# EAGLE design RAM-Rombox (EAGLE 6.5.0)

## Sheet 1 of 2
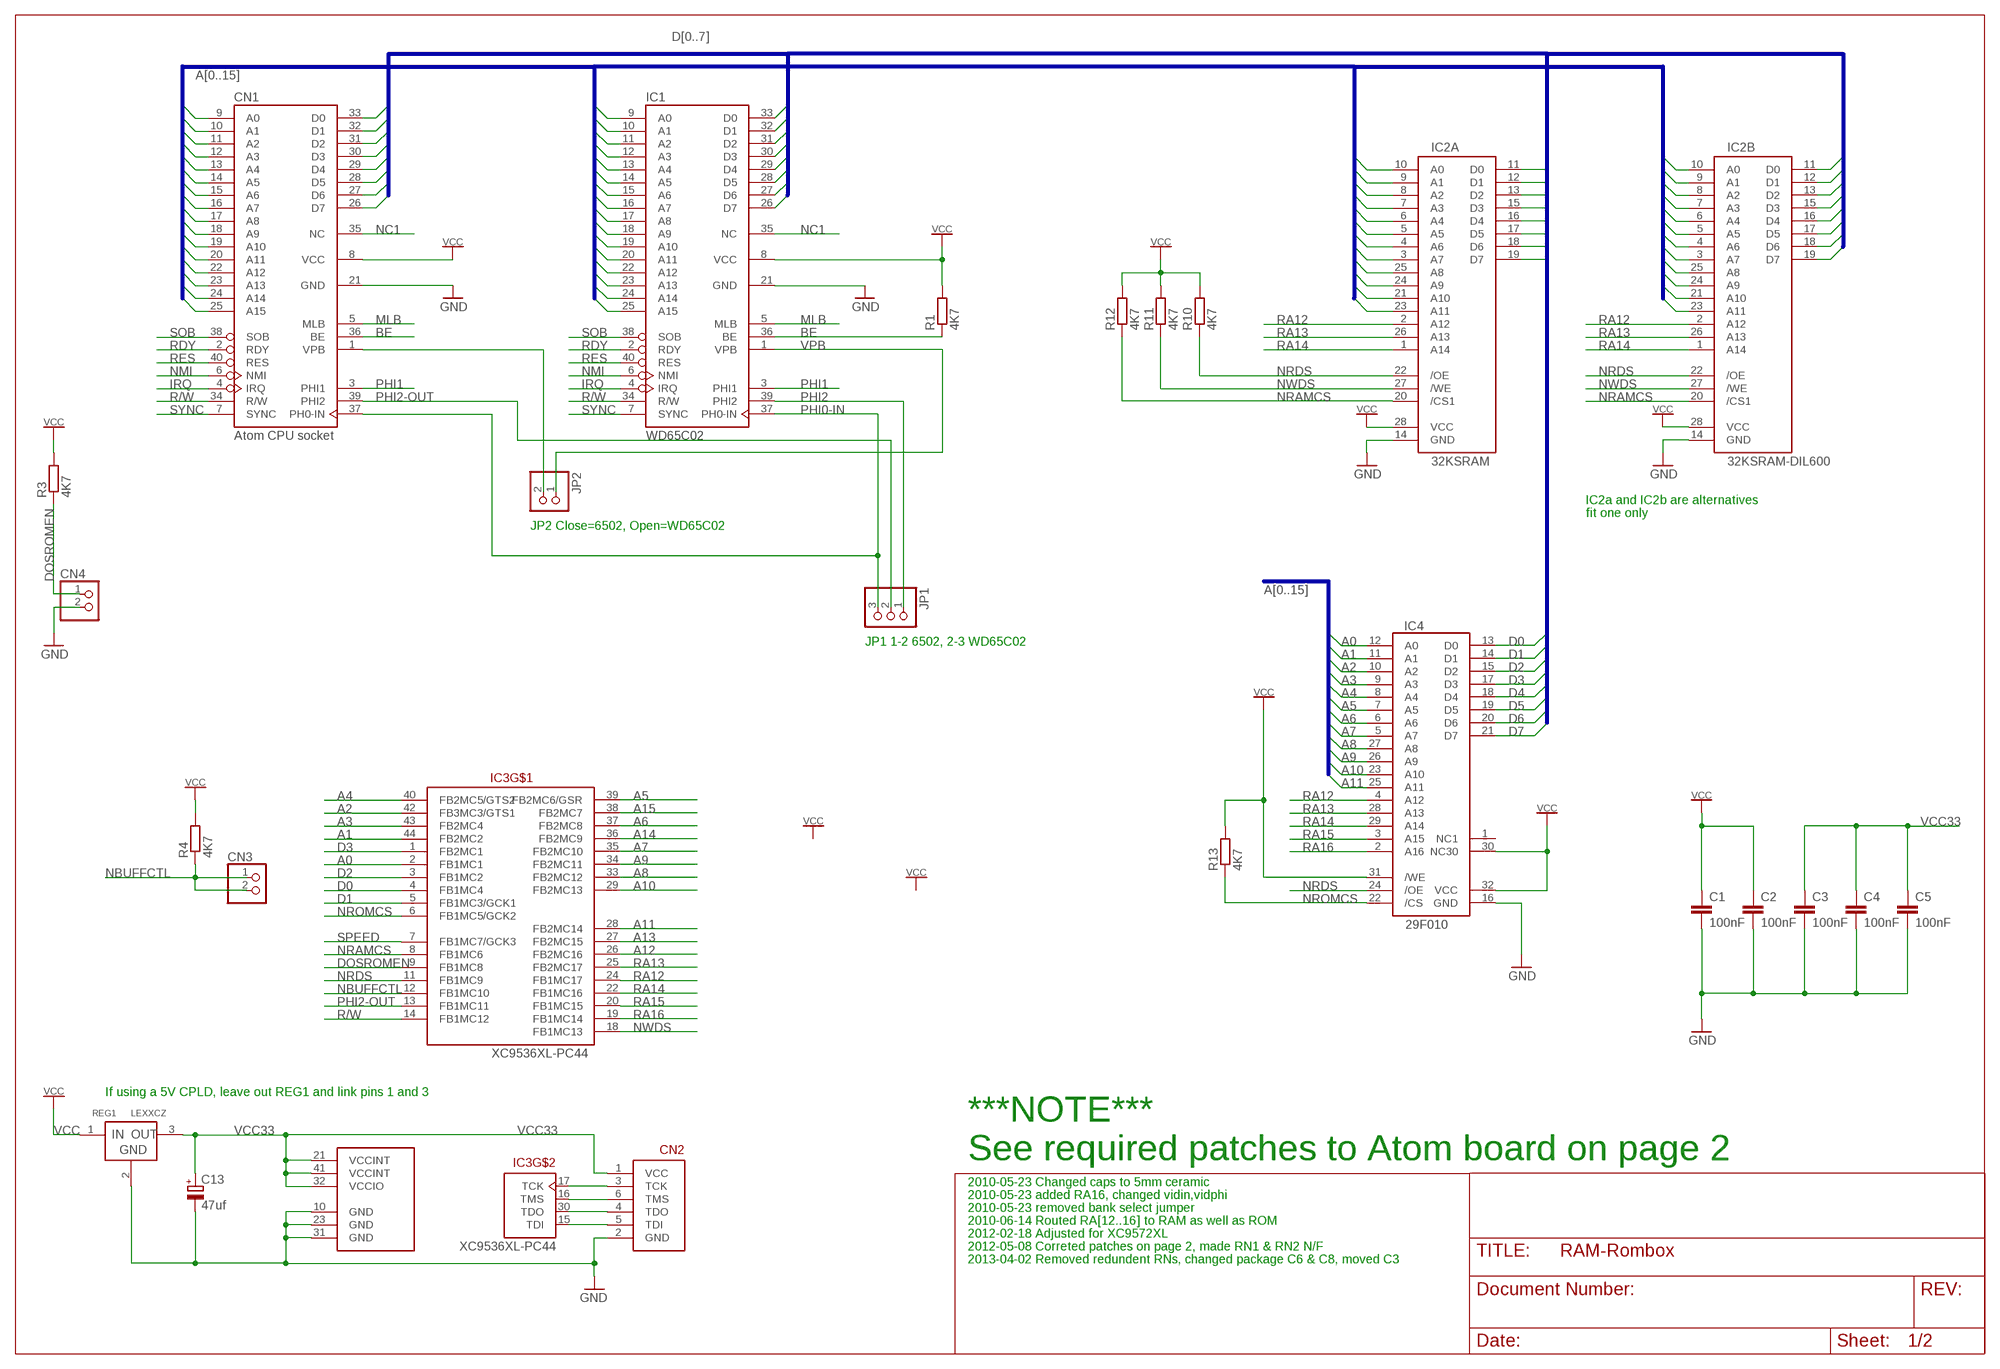
[diagram p0: schematic, sheet 1]

### Parts
C1  100nF  C-EU050-024X044  [C050-024X044]
C2  100nF  C-EU050-024X044  [C050-024X044]
C3  100nF  C-EU025-025X050  [C025-025X050]
C4  100nF  C-EU050-024X044  [C050-024X044]
C5  100nF  C-EU050-024X044  [C050-024X044]
C13  47uf  CPOL-EUTAP5-45  [TAP5-45]
CN1  Atom CPU socket  WD65C02  [DIL40]
CN2  JTAG-CONN  [1X06]
CN3  PINHD-1X2  [1X02]
CN4  PINHD-1X2  [1X02]
IC1  WD65C02  [DIL40]
IC2A  32KSRAM  [DIL28-3]
IC2B  32KSRAM-DIL600  [DIL28-6]
IC3  XC9536XL-PC44  [PLCC-S44]
IC4  29F010  [DIL32]
JP1  PINHD-1X3  [1X03]
JP2  PINHD-1X2  [1X02]
R1  4K7  R-EU_0207/10  [0207/10]
R3  4K7  R-EU_0204/2V  [0204V]
R4  4K7  R-EU_0207/10  [0207/10]
R10  4K7  R-EU_0207/10  [0207/10]
R11  4K7  R-EU_0207/10  [0207/10]
R12  4K7  R-EU_0207/10  [0207/10]
R13  4K7  R-EU_0207/10  [0207/10]
REG1  LEXXCZ  [TO92-]

### Nets
A0: CN1.9(A0) IC1.9(A0) IC2A.10(A0) IC2B.10(A0) IC3.2(FB1MC1) IC4.12(A0)
A1: CN1.10(A1) IC1.10(A1) IC2A.9(A1) IC2B.9(A1) IC3.44(FB2MC2) IC4.11(A1)
A2: CN1.11(A2) IC1.11(A2) IC2A.8(A2) IC2B.8(A2) IC3.42(FB3MC3/GTS1) IC4.10(A2)
A3: CN1.12(A3) IC1.12(A3) IC2A.7(A3) IC2B.7(A3) IC3.43(FB2MC4) IC4.9(A3)
A4: CN1.13(A4) IC1.13(A4) IC2A.6(A4) IC2B.6(A4) IC3.40(FB2MC5/GTS2) IC4.8(A4)
A5: CN1.14(A5) IC1.14(A5) IC2A.5(A5) IC2B.5(A5) IC3.39(FB2MC6/GSR) IC4.7(A5)
A6: CN1.15(A6) IC1.15(A6) IC2A.4(A6) IC2B.4(A6) IC3.37(FB2MC8) IC4.6(A6)
A7: CN1.16(A7) IC1.16(A7) IC2A.3(A7) IC2B.3(A7) IC3.35(FB2MC10) IC4.5(A7)
A8: CN1.17(A8) IC1.17(A8) IC2A.25(A8) IC2B.25(A8) IC3.33(FB2MC12) IC4.27(A8)
A9: CN1.18(A9) IC1.18(A9) IC2A.24(A9) IC2B.24(A9) IC3.34(FB2MC11) IC4.26(A9)
A10: CN1.19(A10) IC1.19(A10) IC2A.21(A10) IC2B.21(A10) IC3.29(FB2MC13) IC4.23(A10)
A11: CN1.20(A11) IC1.20(A11) IC2A.23(A11) IC2B.23(A11) IC3.28(FB2MC14) IC4.25(A11)
A12: CN1.22(A12) IC1.22(A12) IC3.26(FB2MC16)
A13: CN1.23(A13) IC1.23(A13) IC3.27(FB2MC15)
A14: CN1.24(A14) IC1.24(A14) IC3.36(FB2MC9)
A15: CN1.25(A15) IC1.25(A15) IC3.38(FB2MC7)
BE: CN1.36(BE) IC1.36(BE) R1.1
D0: CN1.33(D0) IC1.33(D0) IC2A.11(D0) IC2B.11(D0) IC3.4(FB1MC4) IC4.13(D0)
D1: CN1.32(D1) IC1.32(D1) IC2A.12(D1) IC2B.12(D1) IC3.5(FB1MC3/GCK1) IC4.14(D1)
D2: CN1.31(D2) IC1.31(D2) IC2A.13(D2) IC2B.13(D2) IC3.3(FB1MC2) IC4.15(D2)
D3: CN1.30(D3) IC1.30(D3) IC2A.15(D3) IC2B.15(D3) IC3.1(FB2MC1) IC4.17(D3)
D4: CN1.29(D4) IC1.29(D4) IC2A.16(D4) IC2B.16(D4) IC4.18(D4)
D5: CN1.28(D5) IC1.28(D5) IC2A.17(D5) IC2B.17(D5) IC4.19(D5)
D6: CN1.27(D6) IC1.27(D6) IC2A.18(D6) IC2B.18(D6) IC4.20(D6)
D7: CN1.26(D7) IC1.26(D7) IC2A.19(D7) IC2B.19(D7) IC4.21(D7)
DOSROMEN: CN4.1 IC3.9(FB1MC8) R3.1
GND: C1.2 C2.2 C3.2 C4.2 C5.2 C13.- CN1.21(GND) CN2.2(GND) CN4.2 IC1.21(GND) IC2A.14(GND) IC2B.14(GND) IC3.10(GND) IC3.23(GND) IC3.31(GND) IC4.16(GND) REG1.2(GND) ; also sheet 2
IRQ: CN1.4(IRQ) IC1.4(IRQ)
MLB: CN1.5(MLB) IC1.5(MLB)
N$1: CN1.1(VPB) JP2.2
N$3: CN2.3(TCK) IC3.17(TCK)
N$5: CN2.6(TMS) IC3.16(TMS)
N$6: CN2.4(TDO) IC3.30(TDO)
N$7: CN2.5(TDI) IC3.15(TDI)
NBUFFCTL: CN3.1 CN3.2 IC3.12(FB1MC10) R4.1
NC1: CN1.35(NC) IC1.35(NC)
NMI: CN1.6(NMI) IC1.6(NMI)
NRAMCS: IC2A.20(/CS1) IC2B.20(/CS1) IC3.8(FB1MC6) R12.1
NRDS: IC2A.22(/OE) IC2B.22(/OE) IC3.11(FB1MC9) IC4.24(/OE) R10.1
NROMCS: IC3.6(FB1MC5/GCK2) IC4.22(/CS) R13.1
NWDS: IC2A.27(/WE) IC2B.27(/WE) IC3.18(FB1MC13) R11.1
PHI0-IN: CN1.37(PH0-IN) IC1.37(PH0-IN) JP1.3
PHI1: CN1.3(PHI1) IC1.3(PHI1)
PHI2: IC1.39(PHI2) JP1.1
PHI2-OUT: CN1.39(PHI2) IC3.13(FB1MC11) JP1.2
R/W: CN1.34(R/W) IC1.34(R/W) IC3.14(FB1MC12)
RA12: IC2A.2(A12) IC2B.2(A12) IC3.24(FB1MC17) IC4.4(A12)
RA13: IC2A.26(A13) IC2B.26(A13) IC3.25(FB2MC17) IC4.28(A13)
RA14: IC2A.1(A14) IC2B.1(A14) IC3.22(FB1MC16) IC4.29(A14)
RA15: IC3.20(FB1MC15) IC4.3(A15)
RA16: IC3.19(FB1MC14) IC4.2(A16)
RDY: CN1.2(RDY) IC1.2(RDY)
RES: CN1.40(RES) IC1.40(RES)
SOB: CN1.38(SOB) IC1.38(SOB)
SPEED: IC3.7(FB1MC7/GCK3) ; also sheet 2
SYNC: CN1.7(SYNC) IC1.7(SYNC)
VCC: C1.1 C2.1 CN1.8(VCC) IC1.8(VCC) IC2A.28(VCC) IC2B.28(VCC) IC4.30(NC30) IC4.31(/WE) IC4.32(VCC) R1.2 R3.2 R4.2 R10.2 R11.2 R12.2 R13.2 REG1.1(IN) ; also sheet 2
VCC33: C3.1 C4.1 C5.1 C13.+ CN2.1(VCC) IC3.21(VCCINT) IC3.32(VCCIO) IC3.41(VCCINT) REG1.3(OUT)
VPB: IC1.1(VPB) JP2.1
Unconnected: IC4.1(NC1)

### Buses
A[0..15]
D[0..7]

### Notes on the sheet
- IC2a and IC2b are alternatives
- fit one only
- JP2 Close=6502, Open=WD65C02
- JP1 1-2 6502, 2-3 WD65C02
- If using a 5V CPLD, leave out REG1 and link pins 1 and 3
- ***NOTE***
- See required patches to Atom board on page 2
- 2010-05-23 Changed caps to 5mm ceramic
- 2010-05-23 added RA16, changed vidin,vidphi
- 2010-05-23 removed bank select jumper
- 2010-06-14 Routed RA[12..16] to RAM as well as ROM
- 2012-02-18 Adjusted for XC9572XL
- 2012-05-08 Correted patches on page 2, made RN1 & RN2 N/F
- 2013-04-02 Removed redundent RNs, changed package C6 & C8, moved C3

## Sheet 2 of 2
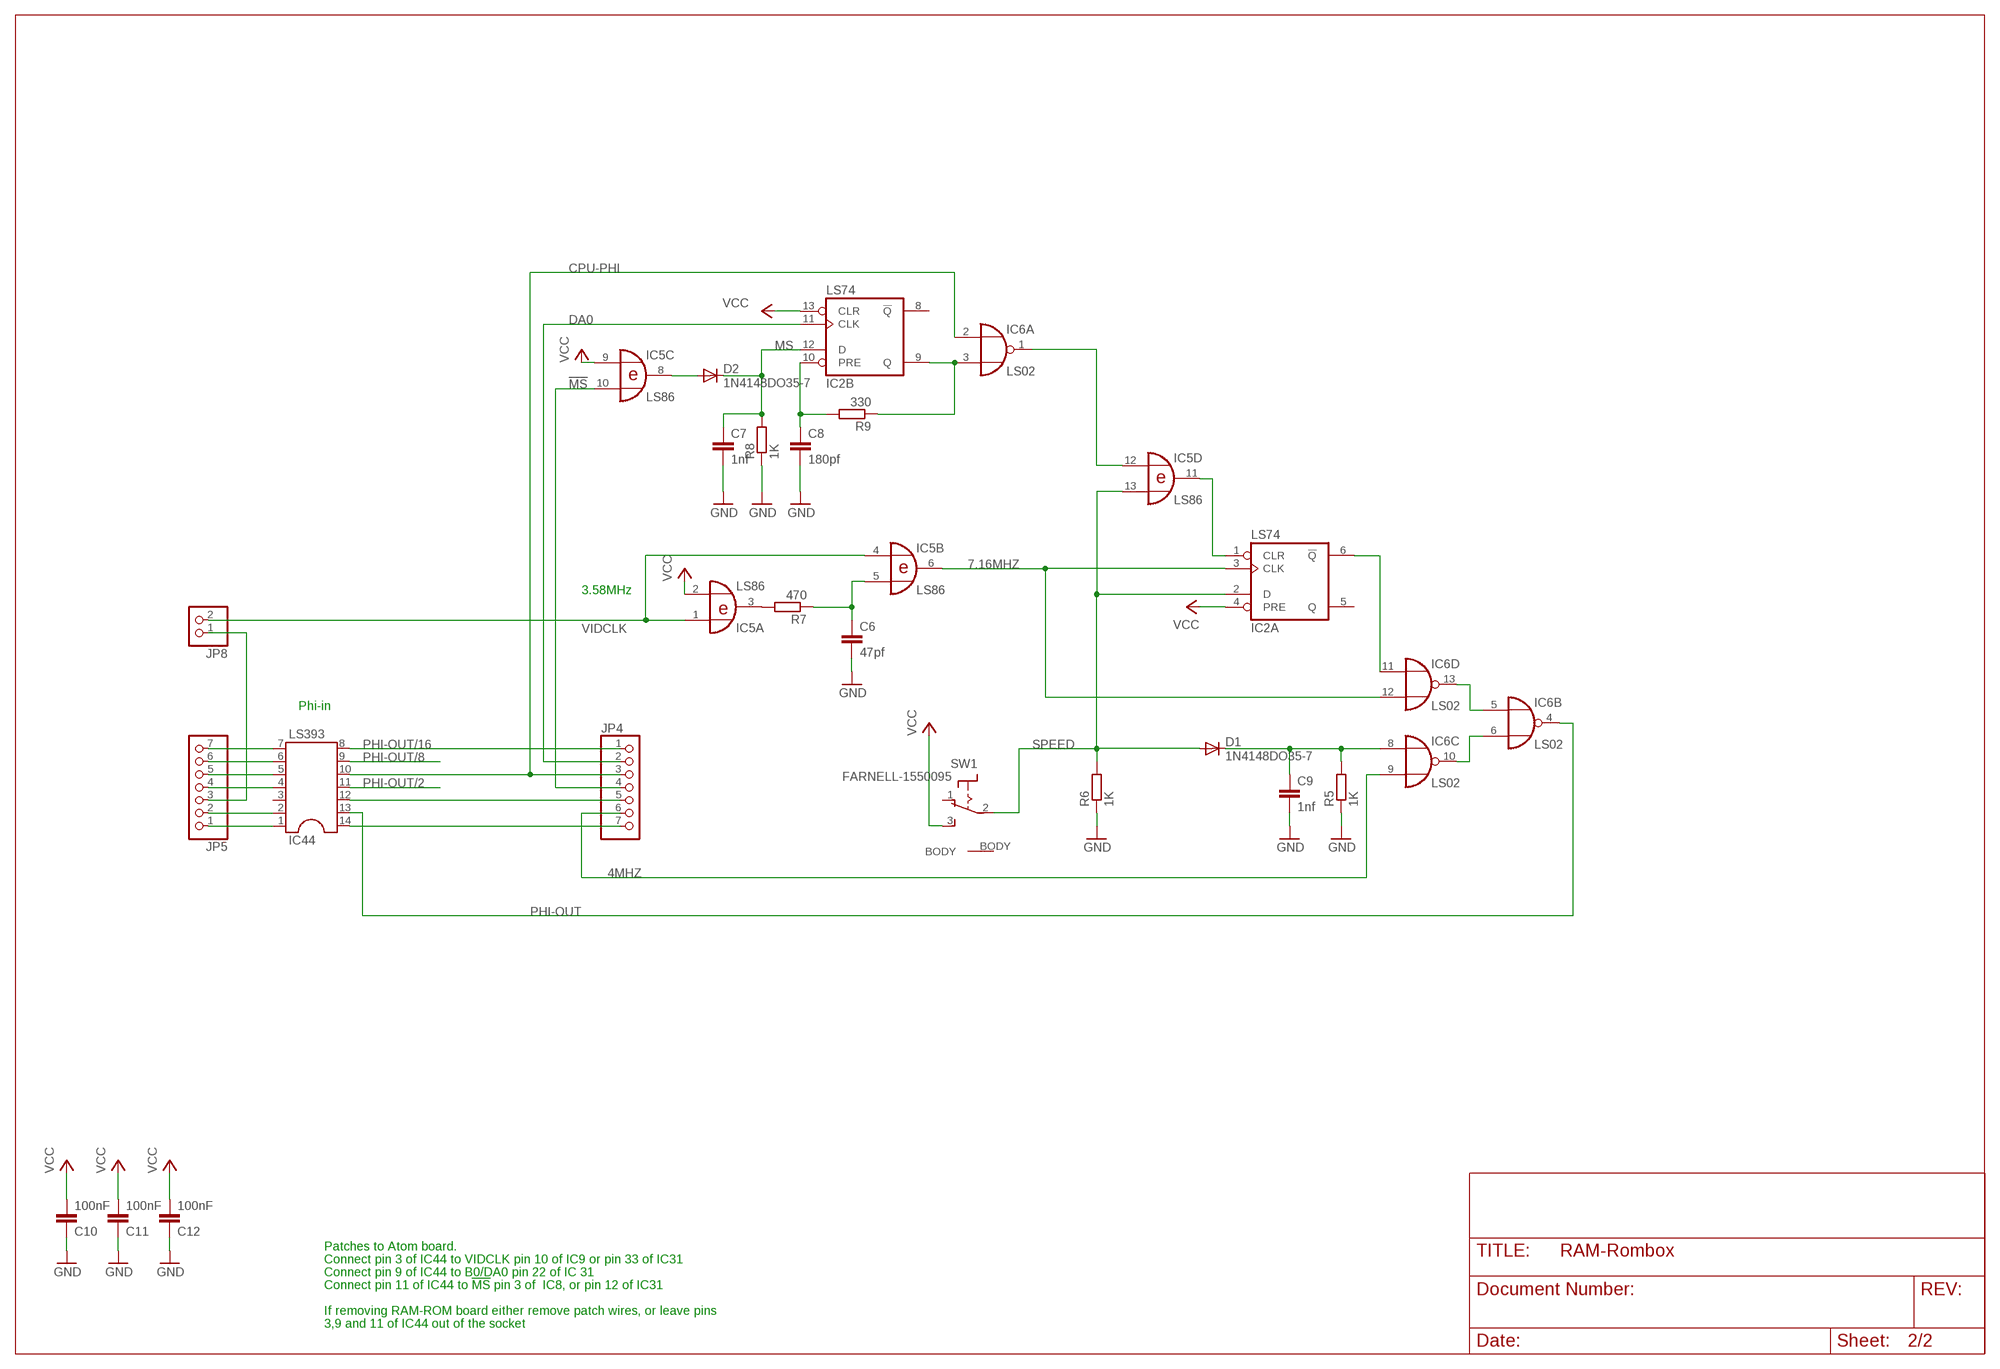
[diagram p1: schematic, sheet 2]

### Parts
C6  47pf  C-EU025-025X050  [C025-025X050]
C7  1nf  C-EU050-024X044  [C050-024X044]
C8  180pf  C-EU025-025X050  [C025-025X050]
C9  1nf  C-EU050-024X044  [C050-024X044]
C10  100nF  C-EU050-024X044  [C050-024X044]
C11  100nF  C-EU050-024X044  [C050-024X044]
C12  100nF  C-EU050-024X044  [C050-024X044]
D1  1N4148DO35-7  [DO35-7]
D2  1N4148DO35-7  [DO35-7]
IC2  LS74  74S74N  [DIL14]
IC5  LS86  7486N  [DIL14]
IC6  LS02  7402N  [DIL14]
IC44  LS393  DIL14  [DIL14]
JP4  PINHD-1X7  [1X07]
JP5  PINHD-1X7  [1X07]
JP8  PINHD-1X2  [1X02]
R5  1K  R-EU_0204/7  [0204/7]
R6  1K  R-EU_0204/7  [0204/7]
R7  470  R-EU_0204/7  [0204/7]
R8  1K  R-EU_0204/7  [0204/7]
R9  330  R-EU_0204/7  [0204/7]
SW1  FARNELL-1550095  [SPST-TOGGLE]

### Nets
4MHZ: IC6.9(C:I1) JP4.6
7.16MHZ: IC2.3(A:CLK) IC5.6(B:O) IC6.12(D:I1)
!MS: IC5.10(C:I1) JP4.4
CPU-PHI: IC6.2(A:I0) IC44.10 JP4.3
DA0: IC2.11(B:CLK) JP4.2
GND: C6.2 C7.2 C8.2 C9.2 C10.1 C11.1 C12.1 R5.1 R6.1 R8.1 ; also sheet 1
MS: C7.1 D2.C IC2.12(B:D) R8.2
N$2: C6.1 IC5.5(B:I1) R7.1
N$4: IC6.6(B:I1) IC6.10(C:O)
N$8: IC6.5(B:I0) IC6.13(D:O)
N$9: IC2.1(A:CLR) IC5.11(D:O)
N$10: IC2.6(A:!Q) IC6.11(D:I0)
N$11: IC5.3(A:O) R7.2
N$12: D2.A IC5.8(C:O)
N$13: JP5.3 JP8.1
N$14: IC5.12(D:I0) IC6.1(A:O)
N$15: IC2.9(B:Q) IC6.3(A:I1) R9.1
N$16: C8.1 IC2.10(B:PRE) R9.2
N$17: IC44.6 JP5.6
N$19: C9.1 D1.C IC6.8(C:I0) R5.2
N$20: IC44.5 JP5.5
N$21: IC44.4 JP5.4
N$23: IC44.2 JP5.2
N$24: IC44.1 JP5.1
N$26: IC44.12 JP4.5
N$27: IC44.14 JP4.7
N$28: IC44.7 JP5.7
PHI-OUT: IC6.4(B:O) IC44.13
PHI-OUT/2: IC44.11
PHI-OUT/8: IC44.9
PHI-OUT/16: IC44.8 JP4.1
SPEED: D1.A IC2.2(A:D) IC5.13(D:I1) R6.2 SW1.2(COMMON) ; also sheet 1
VCC: C10.2 C11.2 C12.2 IC2.4(A:PRE) IC2.13(B:CLR) IC5.2(A:I1) IC5.9(C:I0) SW1.3(RIGHT) ; also sheet 1
VIDCLK: IC5.1(A:I0) IC5.4(B:I0) JP8.2
Unconnected: IC2.5(A:Q) IC2.8(B:!Q) IC44.3 SW1.1(LEFT) SW1.BODY

### Notes on the sheet
- 3.58MHz
- Phi-in
- Patches to Atom board.
- Connect pin 3 of IC44 to VIDCLK pin 10 of IC9 or pin 33 of IC31
- Connect pin 9 of IC44 to B0/DA0 pin 22 of IC 31
- Connect pin 11 of IC44 to !MS! pin 3 of  IC8, or pin 12 of IC31
- If removing RAM-ROM board either remove patch wires, or leave pins
- 3,9 and 11 of IC44 out of the socket

## Power pins joined to a net without a drawn wire
GND: IC2.7(P:GND) IC5.7(P:GND) IC6.7(P:GND)
VCC: IC2.14(P:VCC) IC5.14(P:VCC) IC6.14(P:VCC)

## Library data of the parts
C1-C12 = rcl:C-EU: CAPACITOR, European symbol
C13 = rcl:CPOL-EU: POLARIZED CAPACITOR, European symbol
CN1 IC1 = WDC-65XX:WD65C02
CN2 = Xilinx-CPLD-2:JTAG-CONN: JTAG ISP for programing Xilinx CPLD chips
CN3 CN4 JP2 JP8 = pinhead:PINHD-1X2: PIN HEADER
D1 D2 = Misc:1N4148: DIODE high speed (Philips)
IC2 = 74xx-eu:74*74: Dual D type positive edge triggered FLIP FLOP, preset and clear
IC2A = Rom-Ram:32KSRAM: Standard pinout 32K x 8 bit Static RAM
IC2B = Rom-Ram:32KSRAM-DIL600
IC3 = Xilinx-CPLD-2:XC9536XL-PC44: Xilinx XC9636/XC9536XL in PLCC-44 XC9572 is the same pinout
IC4 = Rom-Ram:29F010
IC5 = 74xx-eu:74*86: Quad 2-input EXCLUSIVE-OR (XOR) gate
IC6 = 74xx-eu:74*02: Quad 2-input NOR gate
IC44 = ic-package:DIL14: Dual In Line / Socket
JP1 = pinhead:PINHD-1X3: PIN HEADER
JP4 JP5 = pinhead:PINHD-1X7: PIN HEADER
R1 R3 R4 R10-R13 = rcl:R-EU_: RESISTOR, European symbol
R5-R9 = resistor:R-EU_: RESISTOR, European symbol
REG1 = Misc:LEXXCZ: LEX33CZ 3.3v voltage reg. also available in other voltages, the 2 digits specify the voltage : 33 = 3.3v 50 = 5.0v etc
SW1 = Switches_phs:FARNELL-1550095

## Board
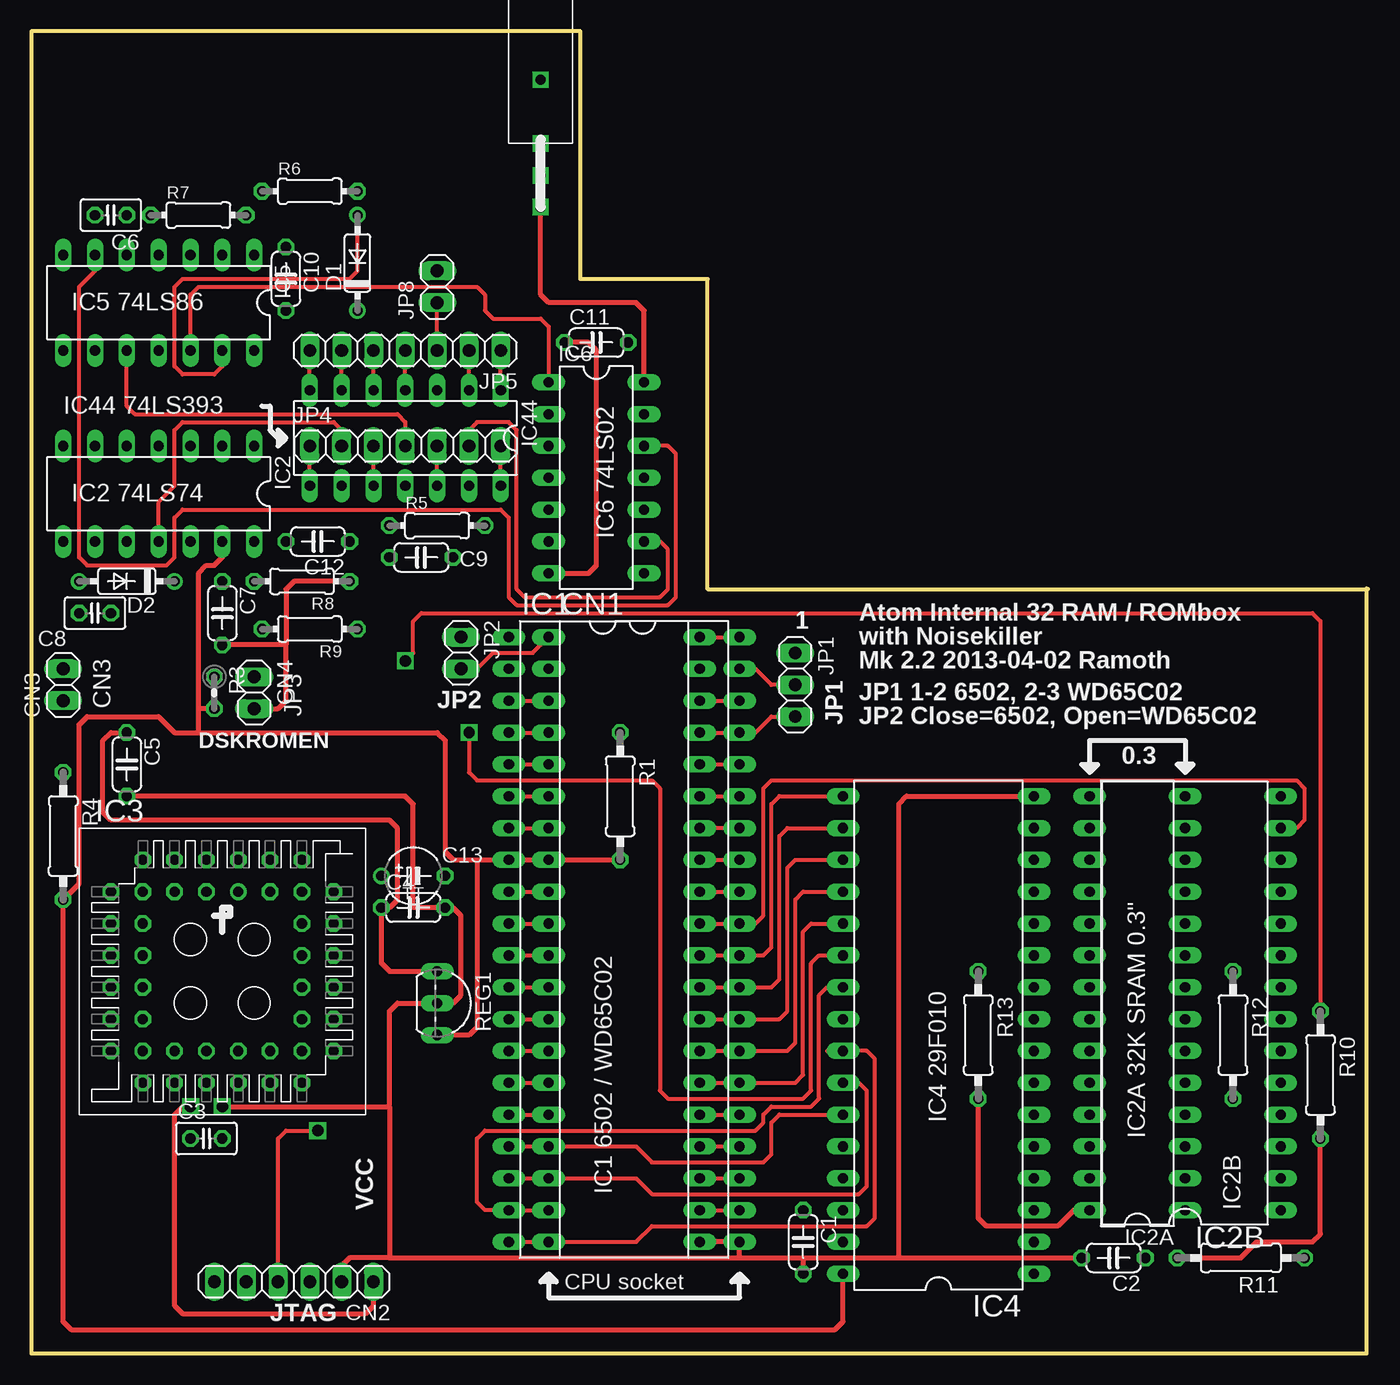
[diagram p2: board, top side]
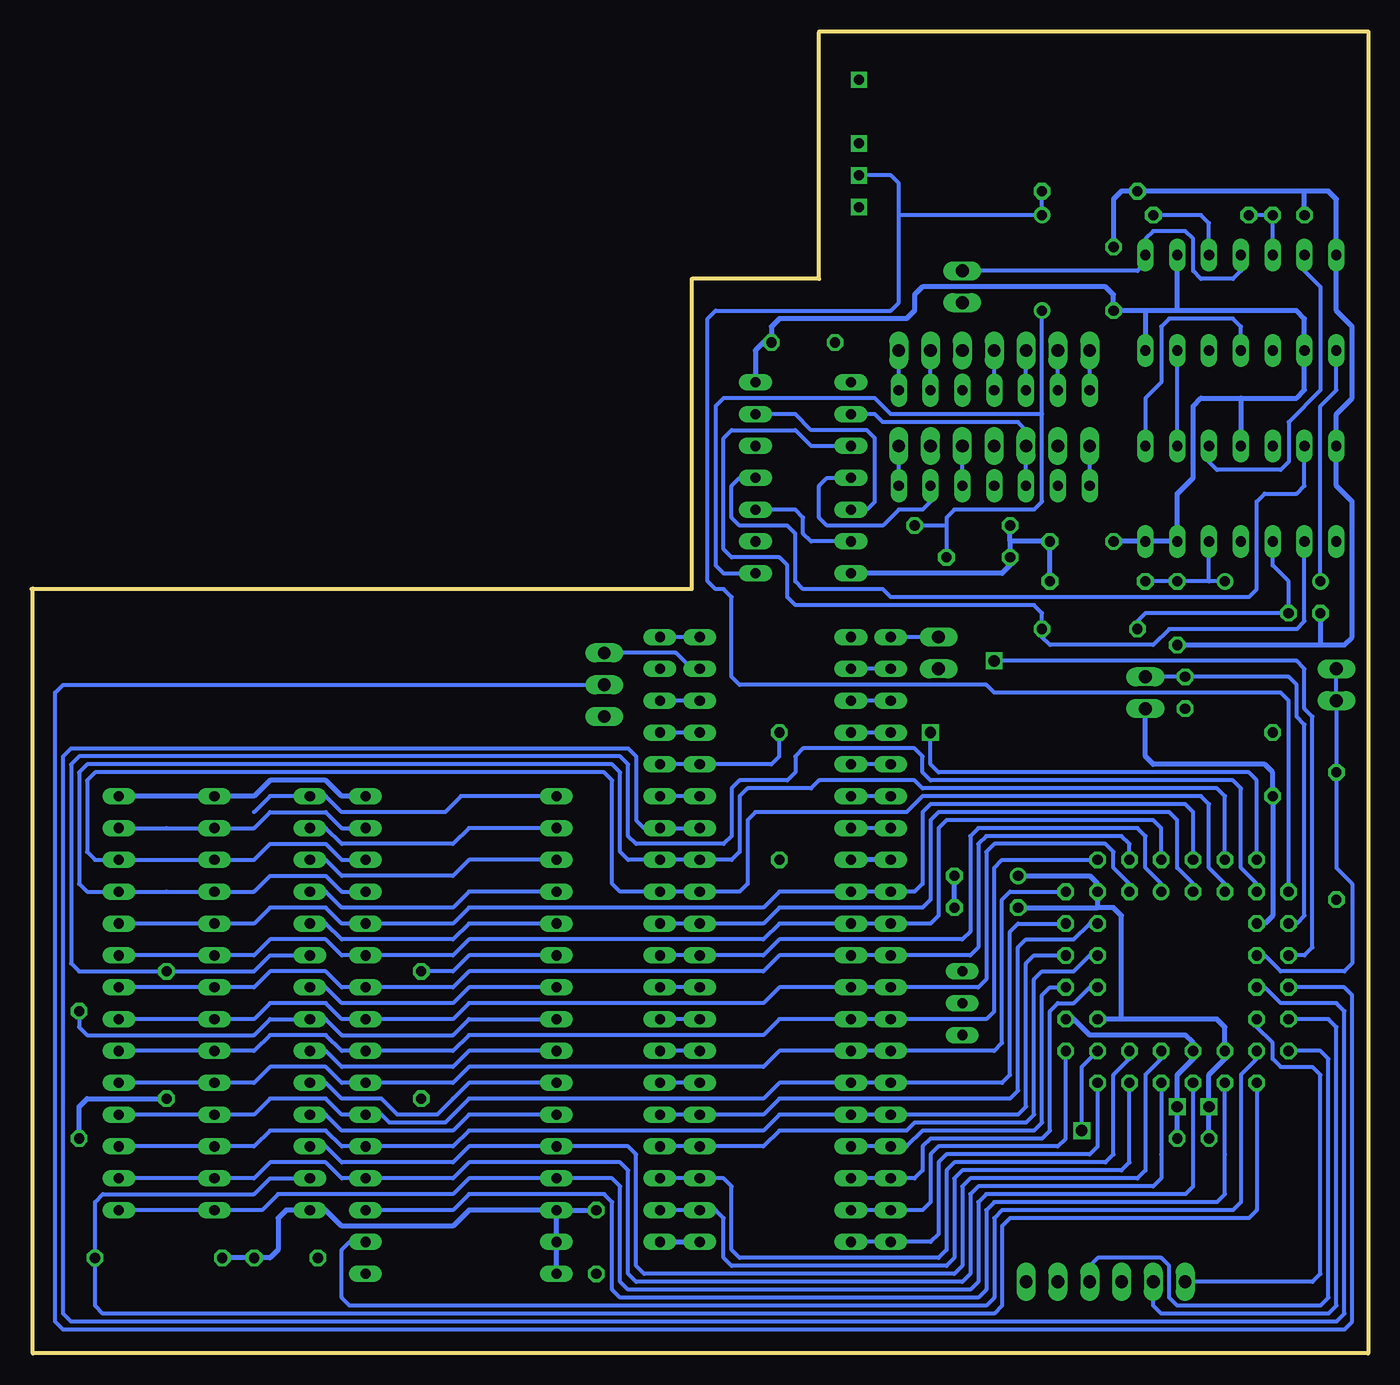
[diagram p3: board, bottom side, seen from below]

Size 106.68 x 105.47 mm. Coordinates in mm from the lower left corner, seen from the top.
Outline: 106.56,61.02 106.56,0 0,0
Outline: 43.81,105.47 0,105.47 0,0
Outline: 106.68,60.96 53.98,60.96 53.98,85.72 43.81,85.72 43.81,105.41
Outline: 0,100 0,0
Copper layers (1*16): Top 0.035mm / dielectric 1.5mm / Bottom 0.035mm
Design rules "default": minimum track width 10mil, minimum drill 24mil, track to track 8mil, track to pad 8mil, pad to pad 8mil, via to via 8mil, smd to smd 8mil, copper to edge 40mil, drill to drill 8mil, minimum pad ring 10mil, minimum via ring 8mil, stop-mask expansion 4mil, vias tented up to drill 0mil, thermal gap 10mil

### Footprints (pad centres in the part's own frame; a part is rotated, then mirrored left to right if it is on the bottom)
C050-024X044 = drill 0.813 octagon: 1 -2.54,0; 2 2.54,0
C025-025X050 = drill 0.813 octagon: 1 -1.27,0; 2 1.27,0
TAP5-45 = drill 0.813: + -2.54,0 | drill 0.813 octagon: - 2.54,0
DIL40 = drill 0.813 long: 1 -24.13,-7.62; 2 -21.59,-7.62; 3 -19.05,-7.62; 4 -16.51,-7.62; 5 -13.97,-7.62; 6 -11.43,-7.62; 7 -8.89,-7.62; 8 -6.35,-7.62; 9 -3.81,-7.62; 10 -1.27,-7.62; 11 1.27,-7.62; 12 3.81,-7.62; 13 6.35,-7.62; 14 8.89,-7.62; 15 11.43,-7.62; 16 13.97,-7.62; 17 16.51,-7.62; 18 19.05,-7.62; 19 21.59,-7.62; 20 24.13,-7.62; 21 24.13,7.62; 22 21.59,7.62; 23 19.05,7.62; 24 16.51,7.62; 25 13.97,7.62; 26 11.43,7.62; 27 8.89,7.62; 28 6.35,7.62; 29 3.81,7.62; 30 1.27,7.62; 31 -1.27,7.62; 32 -3.81,7.62; 33 -6.35,7.62; 34 -8.89,7.62; 35 -11.43,7.62; 36 -13.97,7.62; 37 -16.51,7.62; 38 -19.05,7.62; 39 -21.59,7.62; 40 -24.13,7.62
1X06 = drill 1.016 long: 1 -6.35,0; 2 -3.81,0; 3 -1.27,0; 4 1.27,0; 5 3.81,0; 6 6.35,0
1X02 = drill 1.016 long: 1 -1.27,0; 2 1.27,0
DO35-7 = drill 0.813: A 3.81,0; C -3.81,0
DIL14 = drill 0.813 long: 1 -7.62,-3.81; 2 -5.08,-3.81; 3 -2.54,-3.81; 4 0,-3.81; 5 2.54,-3.81; 6 5.08,-3.81; 7 7.62,-3.81; 8 7.62,3.81; 9 5.08,3.81; 10 2.54,3.81; 11 0,3.81; 12 -2.54,3.81; 13 -5.08,3.81; 14 -7.62,3.81
DIL28-3 = drill 0.813 long: 1 -16.51,-3.81; 2 -13.97,-3.81; 3 -11.43,-3.81; 4 -8.89,-3.81; 5 -6.35,-3.81; 6 -3.81,-3.81; 7 -1.27,-3.81; 8 1.27,-3.81; 9 3.81,-3.81; 10 6.35,-3.81; 11 8.89,-3.81; 12 11.43,-3.81; 13 13.97,-3.81; 14 16.51,-3.81; 15 16.51,3.81; 16 13.97,3.81; 17 11.43,3.81; 18 8.89,3.81; 19 6.35,3.81; 20 3.81,3.81; 21 1.27,3.81; 22 -1.27,3.81; 23 -3.81,3.81; 24 -6.35,3.81; 25 -8.89,3.81; 26 -11.43,3.81; 27 -13.97,3.81; 28 -16.51,3.81
DIL28-6 = drill 0.813 long: 1 -16.51,-7.62; 2 -13.97,-7.62; 3 -11.43,-7.62; 4 -8.89,-7.62; 5 -6.35,-7.62; 6 -3.81,-7.62; 7 -1.27,-7.62; 8 1.27,-7.62; 9 3.81,-7.62; 10 6.35,-7.62; 11 8.89,-7.62; 12 11.43,-7.62; 13 13.97,-7.62; 14 16.51,-7.62; 15 16.51,7.62; 16 13.97,7.62; 17 11.43,7.62; 18 8.89,7.62; 19 6.35,7.62; 20 3.81,7.62; 21 1.27,7.62; 22 -1.27,7.62; 23 -3.81,7.62; 24 -6.35,7.62; 25 -8.89,7.62; 26 -11.43,7.62; 27 -13.97,7.62; 28 -16.51,7.62
PLCC-S44 = drill 0.813: 1 1.27,6.35 | drill 0.813 octagon: 2 -1.27,8.89; 3 -1.27,6.35; 4 -3.81,8.89; 5 -3.81,6.35; 6 -6.35,8.89; 7 -8.89,6.35; 8 -6.35,6.35; 9 -8.89,3.81; 10 -6.35,3.81; 11 -8.89,1.27; 12 -6.35,1.27; 13 -8.89,-1.27; 14 -6.35,-1.27; 15 -8.89,-3.81; 16 -6.35,-3.81; 17 -8.89,-6.35; 18 -6.35,-8.89; 19 -6.35,-6.35; 20 -3.81,-8.89; 21 -3.81,-6.35; 22 -1.27,-8.89; 23 -1.27,-6.35; 24 1.27,-8.89; 25 1.27,-6.35; 26 3.81,-8.89; 27 3.81,-6.35; 28 6.35,-8.89; 29 8.89,-6.35; 30 6.35,-6.35; 31 8.89,-3.81; 32 6.35,-3.81; 33 8.89,-1.27; 34 6.35,-1.27; 35 8.89,1.27; 36 6.35,1.27; 37 8.89,3.81; 38 6.35,3.81; 39 8.89,6.35; 40 6.35,8.89; 41 6.35,6.35; 42 3.81,8.89; 43 3.81,6.35; 44 1.27,8.89
DIL32 = drill 0.813 long: 1 -19.05,-7.62; 2 -16.51,-7.62; 3 -13.97,-7.62; 4 -11.43,-7.62; 5 -8.89,-7.62; 6 -6.35,-7.62; 7 -3.81,-7.62; 8 -1.27,-7.62; 9 1.27,-7.62; 10 3.81,-7.62; 11 6.35,-7.62; 12 8.89,-7.62; 13 11.43,-7.62; 14 13.97,-7.62; 15 16.51,-7.62; 16 19.05,-7.62; 17 19.05,7.62; 18 16.51,7.62; 19 13.97,7.62; 20 11.43,7.62; 21 8.89,7.62; 22 6.35,7.62; 23 3.81,7.62; 24 1.27,7.62; 25 -1.27,7.62; 26 -3.81,7.62; 27 -6.35,7.62; 28 -8.89,7.62; 29 -11.43,7.62; 30 -13.97,7.62; 31 -16.51,7.62; 32 -19.05,7.62
1X03 = drill 1.016 long: 1 -2.54,0; 2 0,0; 3 2.54,0
1X07 = drill 1.016 long: 1 -7.62,0; 2 -5.08,0; 3 -2.54,0; 4 0,0; 5 2.54,0; 6 5.08,0; 7 7.62,0
0207/10 = drill 0.813 octagon: 1 -5.08,0; 2 5.08,0
0204V = drill 0.813 octagon: 1 -1.27,0; 2 1.27,0
0204/7 = drill 0.813 octagon: 1 -3.81,0; 2 3.81,0
TO92- = drill 0.813 long: 1 2.54,-1.27; 2 0,-1.27; 3 -2.54,-1.27
SPST-TOGGLE = drill 0.8 square: 1 0,5.08; 2 0,2.54; 3 0,0; BODY 0,10.16

### Placement (x,y rotation side)
C1  61.59,8.89 270 top
C2  86.36,7.62 180 top
C3  13.97,17.14 0 top
C4  30.48,35.56 0 top
C5  7.62,46.99 270 top
C6  6.35,90.81 180 top
C7  15.24,59.05 270 top
C8  5.08,59.05 180 top
C9  31.11,63.5 180 top
C10  20.32,85.72 270 top
C11  45.09,80.64 0 top
C12  22.86,64.77 180 top
C13  30.48,38.1 0 top
CN1  48.9,33.02 270 top
CN2  20.95,5.71 180 top
CN3  2.54,53.34 90 top
CN4  17.78,52.7 270 top
D1  26.04,87 90 top
D2  7.62,61.59 180 top
IC1  45.72,33.02 270 top
IC2  10.16,68.58 180 top
IC2A  88.27,27.94 90 top
IC2B  92.08,27.94 90 top
IC3  15.24,30.48 0 top
IC4  72.39,25.4 90 top
IC5  10.16,83.82 180 top
IC6  45.09,69.85 270 top
IC44  29.84,73.03 180 top
JP1  60.96,53.34 270 top
JP2  34.29,55.88 270 top
JP4  29.84,72.39 0 top
JP5  29.84,80.01 180 top
JP8  32.38,85.09 90 top
R1  46.99,44.45 270 top
R3  14.61,52.7 270 top
R4  2.54,41.27 270 top
R5  32.38,66.04 0 top
R6  22.23,92.71 0 top
R7  13.34,90.81 0 top
R8  21.59,61.59 180 top
R9  22.23,57.78 180 top
R10  102.87,22.23 270 top
R11  96.52,7.62 180 top
R12  95.89,25.4 270 top
R13  75.56,25.4 270 top
REG1  33.66,27.94 270 top
SW1  40.64,91.44 0 top

### Tracks (layer width: path | path; a pad name or v marks a point on that pad's centre or on a via)
4MHZ
  Top 0.305: IC6.9 50.16,64.77 50.8,64.14 50.8,60.96 50.16,60.33 39.37,60.33 38.73,60.96 38.73,73.66 38.1,74.3 35.56,74.3 34.92,73.66 JP4.6
7.16MHZ
  Top 0.305: IC5.6 5.08,86.36 3.81,85.09 3.81,63.5 4.45,62.87 10.79,62.87 11.43,63.5 11.43,66.67 12.06,67.31 37.47,67.31 38.1,66.67 38.1,60.33 38.73,59.69 50.8,59.69 51.44,60.33 51.44,71.75 50.8,72.39 IC6.12
  Bottom 0.305: IC2.3 12.7,71.12 12.06,70.48 6.99,70.48 6.35,71.12 6.35,74.3 3.81,76.83 3.81,85.09 5.08,86.36 IC5.6
!MS
  Top 0.305: IC5.10 7.62,75.56 8.26,74.93 29.21,74.93 29.84,74.3 JP4.4
A0
  Top 0.305: IC1.9 CN1.9
  Bottom 0.305: IC2B.10 IC2A.10 88.9,34.29 87.63,35.56 83.19,35.56 81.92,34.29 IC4.12 73.03,34.29 71.75,35.56 48.26,35.56 46.99,36.83 CN1.9 IC1.9 36.2,36.83 35.56,37.47 35.56,43.18 34.92,43.81 14.61,43.81 13.97,43.18 IC3.2
A1
  Top 0.305: IC1.10 CN1.10
  Bottom 0.305: IC2B.9 IC2A.9 88.9,31.75 87.63,33.02 83.19,33.02 81.92,31.75 IC4.11 73.03,31.75 71.75,33.02 48.26,33.02 46.99,34.29 CN1.10 IC1.10 34.92,34.29 34.29,34.92 34.29,41.91 33.66,42.55 17.14,42.55 16.51,41.91 IC3.44
A2
  Top 0.305: IC1.11 CN1.11
  Bottom 0.305: IC2B.8 IC2A.8 88.9,29.21 87.63,30.48 83.19,30.48 81.92,29.21 IC4.10 73.03,29.21 71.75,30.48 48.26,30.48 46.99,31.75 CN1.11 IC1.11 31.75,31.75 31.11,32.38 31.11,40.64 30.48,41.27 19.68,41.27 19.05,40.64 IC3.42
A3
  Top 0.305: IC1.12 CN1.12
  Bottom 0.305: IC2B.7 IC2A.7 88.9,26.67 87.63,27.94 83.19,27.94 81.92,26.67 IC4.9 73.03,26.67 71.75,27.94 48.26,27.94 46.99,29.21 CN1.12 IC1.12 31.11,29.21 30.48,29.84 30.48,40.01 29.84,40.64 20.95,40.64 20.32,40.01 20.32,38.73 19.05,37.47 IC3.43
A4
  Top 0.305: IC1.13 CN1.13
  Bottom 0.305: IC2B.6 IC2A.6 88.9,24.13 87.63,25.4 83.19,25.4 81.92,24.13 IC4.8 73.03,24.13 71.75,25.4 48.26,25.4 46.99,26.67 CN1.13 IC1.13 30.48,26.67 29.84,27.3 29.84,38.73 29.21,39.37 IC3.40
A5
  Top 0.305: IC1.14 CN1.14
  Bottom 0.305: IC3.39 28.57,36.83 29.21,36.2 29.21,24.77 29.84,24.13 IC1.14 CN1.14 46.99,24.13 48.26,22.86 71.75,22.86 73.03,21.59 IC4.7 81.92,21.59 83.19,22.86 87.63,22.86 88.9,21.59 IC2A.5 IC2B.5
A6
  Top 0.305: IC1.15 CN1.15
  Bottom 0.305: IC2B.4 IC2A.4 88.9,19.05 87.63,20.32 83.19,20.32 81.92,19.05 IC4.6 78.74,19.05 78.11,18.41 73.66,18.41 71.75,20.32 48.26,20.32 46.99,21.59 CN1.15 IC1.15 29.21,21.59 28.57,22.23 28.57,33.66 27.94,34.29 IC3.37
A7
  Top 0.305: IC1.16 CN1.16
  Bottom 0.305: IC2B.3 IC2A.3 88.9,16.51 87.63,17.78 83.19,17.78 81.92,16.51 IC4.5 73.03,16.51 71.75,17.78 48.26,17.78 46.99,19.05 CN1.16 IC1.16 27.94,19.05 27.3,19.68 27.3,31.11 26.67,31.75 IC3.35
A8
  Top 0.305: IC1.17 CN1.17 48.26,16.51 49.53,15.24 58.42,15.24 59.05,15.88 59.05,18.41 59.69,19.05 IC4.27
  Bottom 0.305: IC4.27 71.75,19.05 73.03,17.78 81.92,17.78 83.19,19.05 IC2B.25 | IC3.33 25.4,29.21 26.04,28.57 26.04,18.41 26.67,17.78 35.56,17.78 36.83,16.51 IC1.17 CN1.17
A9
  Top 0.305: IC1.18 CN1.18 48.26,13.97 49.53,12.7 66.04,12.7 66.67,13.34 66.67,20.95 66.04,21.59 IC4.26
  Bottom 0.305: IC4.26 71.75,21.59 73.03,20.32 73.66,19.68 74.3,19.05 77.47,19.05 78.74,20.32 81.92,20.32 83.19,21.59 IC2B.24 | IC3.34 22.23,29.21 23.5,27.94 24.77,27.94 25.4,27.3 25.4,17.78 26.04,17.14 34.92,17.14 35.56,16.51 35.56,14.61 36.2,13.97 IC1.18 CN1.18
A10
  Top 0.305: CN1.19 IC1.19 36.2,11.43 35.56,12.06 35.56,17.14 36.2,17.78 57.78,17.78 58.42,18.41 58.42,19.05 59.05,19.68 62.23,19.68 62.87,20.32 62.87,28.57 63.5,29.21 IC4.23
  Bottom 0.305: IC4.23 71.75,29.21 73.03,27.94 81.92,27.94 83.19,29.21 IC2B.21 | IC3.29 24.13,17.14 24.77,16.51 34.29,16.51 34.92,15.88 34.92,12.06 35.56,11.43 IC1.19 CN1.19
A11
  Top 0.305: IC1.20 CN1.20 48.26,8.89 49.53,10.16 66.67,10.16 67.31,10.79 67.31,23.5 66.67,24.13 IC4.25 63.5,24.13
  Bottom 0.305: IC4.25 71.75,24.13 73.03,22.86 81.92,22.86 83.19,24.13 IC2B.23 | IC3.28 21.59,16.51 22.23,15.88 33.66,15.88 34.29,15.24 34.29,9.53 34.92,8.89 IC1.20 CN1.20
A12
  Top 0.305: IC1.22 CN1.22
  Bottom 0.305: IC3.26 19.05,15.24 19.68,14.61 32.38,14.61 33.02,13.97 33.02,7.62 33.66,6.99 50.8,6.99 51.44,7.62 51.44,10.79 52.07,11.43 IC1.22 CN1.22
A13
  Top 0.305: IC1.23 CN1.23
  Bottom 0.305: IC3.27 19.05,23.5 20.32,22.23 20.32,15.88 20.95,15.24 33.02,15.24 33.66,14.61 33.66,8.26 34.29,7.62 50.16,7.62 50.8,8.26 50.8,13.34 51.44,13.97 IC1.23 CN1.23
A14
  Top 0.305: IC1.24 CN1.24
  Bottom 0.305: IC3.36 22.23,31.75 23.5,30.48 26.04,30.48 26.67,29.84 26.67,19.05 27.3,18.41 36.2,18.41 36.83,17.78 46.99,17.78 48.26,16.51 IC1.24 CN1.24
A15
  Top 0.305: IC1.25 CN1.25
  Bottom 0.305: IC3.38 22.23,34.29 23.5,33.02 27.3,33.02 27.94,32.38 27.94,20.95 28.57,20.32 46.99,20.32 48.26,19.05 IC1.25 CN1.25
BE
  Top 0.305: IC1.36 CN1.36
  Bottom 0.305: R1.1 46.99,47.62 47.62,46.99 IC1.36 CN1.36
CPU-PHI
  Top 0.305: IC44.10 JP4.3
  Bottom 0.305: IC6.2 39.37,74.93 38.73,74.3 27.94,74.3 27.3,73.66 JP4.3 IC44.10
D0
  Top 0.305: IC1.33 CN1.33
  Bottom 0.305: IC4.13 81.92,36.83 83.19,38.1 87.63,38.1 88.9,36.83 IC2A.11 95.89,36.83 IC2B.11 102.23,36.83 102.87,37.47 102.87,46.35 102.23,46.99 60.33,46.99 59.69,46.35 59.69,40.01 59.05,39.37 CN1.33 IC1.33 50.8,39.37 50.16,40.01 50.16,44.45 49.53,45.09 44.45,45.09 43.81,45.72 36.2,45.72 35.56,45.09 12.06,45.09 11.43,44.45 IC3.4
D1
  Top 0.305: IC1.32 CN1.32
  Bottom 0.305: IC4.14 81.92,39.37 83.19,40.64 87.63,40.64 88.9,39.37 IC2A.12 95.89,39.37 IC2B.12 101.6,39.37 102.23,40.01 102.23,45.72 101.6,46.35 60.96,46.35 60.33,45.72 60.33,37.47 59.69,36.83 CN1.32 IC1.32 50.16,36.83 49.53,37.47 49.53,42.55 48.9,43.18 36.83,43.18 35.56,44.45 13.34,44.45 12.7,43.81 12.7,38.73 11.43,37.47 IC3.5
D2
  Top 0.305: IC1.31 CN1.31 57.78,34.29 58.42,34.92 58.42,45.09 59.05,45.72 100.97,45.72 101.6,45.09 101.6,42.55 100.97,41.91 IC2B.13
  Bottom 0.305: IC4.15 81.92,41.91 83.19,43.18 87.63,43.18 88.9,41.91 IC2A.13 95.89,41.91 IC2B.13 | IC3.3 13.97,37.47 15.24,38.73 15.24,42.55 15.88,43.18 34.29,43.18 34.92,42.55 34.92,36.2 35.56,35.56 46.99,35.56 48.26,34.29 IC1.31 CN1.31
D3
  Top 0.305: IC1.30 CN1.30 58.42,31.75 59.05,32.38 59.05,43.81 59.69,44.45 IC4.17
  Bottom 0.305: IC4.17 72.39,44.45 73.66,43.18 81.92,43.18 83.19,44.45 IC2B.15 87.63,44.45 88.9,43.18 | IC3.1 16.51,37.47 17.78,38.73 17.78,41.27 18.41,41.91 31.11,41.91 31.75,41.27 31.75,33.66 32.38,33.02 46.99,33.02 48.26,31.75 IC1.30 CN1.30
D4
  Top 0.305: IC1.29 CN1.29 59.05,29.21 59.69,29.84 59.69,41.27 60.33,41.91 IC4.18
  Bottom 0.305: IC4.18 71.75,41.91 73.03,40.64 81.92,40.64 83.19,41.91 IC2B.16 | IC1.29 CN1.29
D5
  Top 0.305: IC1.28 CN1.28 59.69,26.67 60.33,27.3 60.33,38.73 60.96,39.37 IC4.19
  Bottom 0.305: IC2B.17 83.19,39.37 81.92,38.1 73.03,38.1 71.75,39.37 IC4.19 | IC1.28 CN1.28
D6
  Top 0.305: IC1.27 CN1.27 60.33,24.13 60.96,24.77 60.96,36.2 61.59,36.83 IC4.20
  Bottom 0.305: IC2B.18 83.19,36.83 81.92,35.56 73.03,35.56 71.75,36.83 IC4.20 | IC1.27 CN1.27
D7
  Top 0.305: IC1.26 CN1.26 60.96,21.59 61.59,22.23 61.59,33.66 62.23,34.29 IC4.21
  Bottom 0.305: IC2B.19 83.19,34.29 81.92,33.02 73.03,33.02 71.75,34.29 IC4.21 | IC1.26 CN1.26
DA0
  Top 0.305: JP4.2 24.77,73.66 24.13,74.3 12.06,74.3 11.43,73.66 11.43,69.22 10.16,67.94 IC2.11
DOSROMEN
  Bottom 0.305: IC3.9 5.71,34.29 5.08,34.92 5.08,50.16 5.71,50.8 5.71,53.34 6.35,53.98 R3.1 CN4.1
GND  (via drill 0.9)
  Top 0.406: IC1.21 CN1.21 56.52,7.62 | 69.22,7.62 69.22,43.81 69.85,44.45 IC4.16 | CN2.2 24.77,6.99 25.4,7.62 28.57,7.62 | 28.57,7.62 56.52,7.62 | 56.52,7.62 61.59,7.62 | 61.59,7.62 69.22,7.62 | C11.1 44.45,80.64 45.09,80.01 45.09,62.87 44.45,62.23 IC6.7 | 61.59,7.62 C1.2 | 69.22,7.62 C2.2 | 20.32,56.52 C7.2 | C5.2 29.84,44.45 30.48,43.81 30.48,35.56 C4.2 33.66,35.56 34.29,34.92 34.29,28.57 33.66,27.94 REG1.2 29.21,27.94 28.57,27.3 28.57,19.68 | 28.57,19.68 28.57,7.62 | v15.24,19.68 28.57,19.68 | CN4.2 19.68,51.44 20.32,52.07 20.32,56.52 | R8.1 20.95,61.59 20.32,60.96 20.32,56.52
  Bottom 0.406: IC4.16 81.92,44.45 83.19,45.72 87.63,45.72 88.9,44.45 IC2A.14 IC2B.14 | C7.2 3.81,56.52 | 3.81,56.52 1.91,56.52 1.27,57.15 1.27,67.94 2.54,69.22 IC2.7 2.54,74.93 1.27,76.2 1.27,81.92 2.54,83.19 IC5.7 2.54,92.08 3.17,92.71 5.08,92.71 | R8.1 C12.1 28.57,64.77 | CN1.21 IC1.21 | 5.08,92.71 R6.1 19.68,92.71 20.32,92.08 C10.1 | 28.57,64.77 R5.1 | 28.57,64.77 C9.2 28.57,62.87 29.21,62.23 IC6.7 | IC3.10 8.26,34.29 7.62,34.92 C5.2 7.62,46.35 8.26,46.99 17.14,46.99 17.78,47.62 CN4.2 | IC3.31 23.5,26.67 22.23,25.4 14.61,25.4 13.97,24.77 IC3.23 13.97,23.5 15.24,22.23 v15.24,19.68 C3.2 | C4.2 C13.- | C8.2 3.81,56.52 | C6.2 5.08,92.71
IRQ
  Top 0.305: IC1.4 CN1.4
  Bottom 0.305: IC1.4 CN1.4
MLB
  Top 0.305: IC1.5 CN1.5
  Bottom 0.305: IC1.5 CN1.5
MS
  Bottom 0.305: D2.C 12.7,61.59 | 12.7,61.59 C7.1 R8.2 | 12.7,61.59 IC2.12
N$1
  Top 0.305: JP2.2 35.56,54.61 36.83,55.88 40.01,55.88 CN1.1
N$2
  Bottom 0.305: IC5.5 C6.1 R7.1
N$3
  Bottom 0.305: IC3.17 3.81,24.13 3.17,23.5 3.17,4.45 3.81,3.81 15.24,3.81 15.88,4.45 15.88,6.99 16.51,7.62 21.59,7.62 22.23,6.99 CN2.3
N$4
  Bottom 0.305: IC6.6 44.45,64.77 45.09,65.41 45.09,66.67 45.72,67.31 IC6.10
N$5
  Bottom 0.305: IC3.16 8.89,26.04 7.62,24.77 7.62,23.5 6.99,22.86 4.45,22.86 3.81,22.23 3.81,6.35 4.45,5.71 CN2.6
N$6  (via drill 0.9)
  Top 0.305: CN2.4 19.68,17.14 20.32,17.78 v22.86,17.78
  Bottom 0.305: v22.86,17.78 22.86,22.86 IC3.30
N$7
  Bottom 0.305: IC3.15 3.17,26.67 2.54,26.04 2.54,3.81 3.17,3.17 16.51,3.17 17.14,3.81 CN2.5
N$8
  Bottom 0.305: IC6.13 45.72,74.93 44.45,73.66 40.01,73.66 39.37,73.03 39.37,67.94 40.01,67.31 IC6.5
N$9
  Bottom 0.305: IC5.11 10.16,81.92 10.79,82.55 15.88,82.55 16.51,81.92 16.51,77.47 17.78,76.2 IC2.1
N$10
  Bottom 0.305: IC2.6 5.08,69.22 5.71,68.58 8.26,68.58 8.89,67.94 8.89,60.96 9.53,60.33 38.1,60.33 38.73,60.96 45.09,60.96 45.72,61.59 45.72,65.41 46.35,66.04 50.16,66.04 50.8,66.67 50.8,69.22 50.16,69.85 IC6.11
N$11
  Bottom 0.305: R7.2 13.34,90.81 12.7,90.17 IC5.3
N$12
  Bottom 0.305: IC5.8 2.54,76.83 3.81,75.56 D2.A
N$13
  Top 0.305: JP5.3 JP8.1
N$14
  Top 0.305: IC5.12 12.7,84.45 13.34,85.09 35.56,85.09 36.2,84.45 36.2,83.19 36.83,82.55 40.64,82.55 41.27,81.92 IC6.1
N$15
  Bottom 0.305: IC2.9 5.08,58.42 5.71,57.78 15.88,57.78 17.14,56.52 25.4,56.52 26.04,57.15 R9.1 26.04,59.05 26.67,59.69 45.72,59.69 46.35,60.33 46.35,62.87 46.99,63.5 50.8,63.5 51.44,64.14 51.44,73.03 50.8,73.66 45.72,73.66 44.45,72.39 IC6.3
N$16
  Bottom 0.305: IC2.10 7.62,62.87 6.35,61.59 C8.1 17.78,59.05 18.41,58.42 R9.2
N$17
  Top 0.305: IC44.6 JP5.6
  Bottom 0.305: IC44.6 JP5.6
N$19
  Bottom 0.305: IC6.8 51.44,62.23 52.07,62.87 52.07,75.56 51.44,76.2 39.37,76.2 38.1,74.93 26.04,74.93 | 26.04,74.93 26.04,67.94 26.67,67.31 33.02,67.31 33.66,66.67 33.66,66.04 | 26.04,74.93 D1.C | 33.66,66.04 C9.1 | 33.66,66.04 R5.2
N$20
  Top 0.305: IC44.5 JP5.5
  Bottom 0.305: IC44.5 JP5.5
N$21
  Top 0.305: IC44.4 JP5.4
  Bottom 0.305: IC44.4 JP5.4
N$23
  Top 0.305: IC44.2 JP5.2
  Bottom 0.305: IC44.2 JP5.2
N$24
  Top 0.305: IC44.1 JP5.1
  Bottom 0.305: IC44.1 JP5.1
N$26
  Top 0.305: IC44.12 JP4.5
  Bottom 0.305: IC44.12 JP4.5
N$27
  Top 0.305: IC44.14 JP4.7
  Bottom 0.305: IC44.14 JP4.7
N$28
  Top 0.305: IC44.7 JP5.7
  Bottom 0.305: IC44.7 JP5.7
NBUFFCTL
  Bottom 0.305: CN3.2 CN3.1 R4.1 2.54,38.73 1.27,37.47 1.27,31.11 1.91,30.48 6.99,30.48 8.26,31.75 IC3.12
NC1
  Top 0.305: IC1.35 CN1.35
  Bottom 0.305: IC1.35 CN1.35
NMI
  Top 0.305: IC1.6 CN1.6
  Bottom 0.305: IC1.6 CN1.6
NRAMCS
  Bottom 0.305: IC2B.20 87.63,31.75 88.9,30.48 R12.1 102.87,30.48 103.5,31.11 103.5,46.99 102.87,47.62 59.69,47.62 59.05,46.99 59.05,41.27 58.42,40.64 51.44,40.64 50.8,41.27 50.8,45.09 50.16,45.72 46.35,45.72 45.72,46.35 45.72,47.62 45.09,48.26 36.2,48.26 35.56,47.62 35.56,46.35 34.92,45.72 10.79,45.72 10.16,45.09 10.16,38.73 8.89,37.47 IC3.8
NRDS  (via drill 0.9)
  Top 0.305: v29.84,55.24 30.48,55.88 30.48,58.42 31.11,59.05 102.23,59.05 102.87,58.42 R10.1
  Bottom 0.305: IC4.24 71.75,26.67 73.03,25.4 81.92,25.4 83.19,26.67 IC2B.22 87.63,26.67 88.9,25.4 102.23,25.4 102.87,26.04 R10.1 | v29.84,55.24 5.71,55.24 5.08,54.61 5.08,51.44 4.45,50.8 4.45,32.38 5.08,31.75 IC3.11
NROMCS  (via drill 0.9)
  Top 0.305: IC4.22 62.87,31.75 62.23,31.11 62.23,20.95 61.59,20.32 50.8,20.32 50.16,20.95 50.16,45.09 49.53,45.72 35.56,45.72 34.92,46.35 v34.92,49.53
  Bottom 0.305: v34.92,49.53 34.92,46.99 34.29,46.35 9.53,46.35 8.89,45.72 IC3.6 | R13.1 73.03,30.48 71.75,31.75 IC4.22
NWDS
  Bottom 0.305: IC2B.27 87.63,13.97 88.9,12.7 100.97,12.7 101.6,12.06 R11.1 101.6,3.81 100.97,3.17 29.84,3.17 29.21,3.81 29.21,10.16 28.57,10.79 9.53,10.79 8.89,11.43 IC3.18
PHI0-IN
  Top 0.305: IC1.37 CN1.37 57.78,49.53 59.05,50.8 JP1.3
  Bottom 0.305: IC1.37 CN1.37
PHI1
  Top 0.305: IC1.3 CN1.3
  Bottom 0.305: IC1.3 CN1.3
PHI2
  Bottom 0.305: IC1.39 53.98,54.61 55.24,55.88 JP1.1
PHI2-OUT
  Top 0.305: CN1.39 57.78,54.61 59.05,53.34 JP1.2
  Bottom 0.305: IC3.13 1.91,29.21 1.27,28.57 1.27,2.54 1.91,1.91 104.14,1.91 104.78,2.54 104.78,52.7 104.14,53.34 JP1.2
PHI-OUT
  Bottom 0.305: IC44.13 34.92,67.94 35.56,67.31 37.47,67.31 38.73,66.04 43.18,66.04 43.81,66.67 43.81,69.22 43.18,69.85 IC6.4
PHI-OUT/16
  Top 0.305: IC44.8 JP4.1
  Bottom 0.305: IC44.8 JP4.1
R/W
  Top 0.305: CN1.34 IC1.34
  Bottom 0.305: IC3.14 8.26,29.21 6.99,27.94 2.54,27.94 1.91,27.3 1.91,3.17 2.54,2.54 103.5,2.54 104.14,3.17 104.14,47.62 103.5,48.26 59.05,48.26 58.42,47.62 58.42,42.55 57.78,41.91 CN1.34 IC1.34
RA12
  Bottom 0.305: IC2B.2 IC2A.2 88.9,13.97 87.63,15.24 83.19,15.24 81.92,13.97 IC4.4 73.03,13.97 71.75,15.24 59.69,15.24 59.05,14.61 59.05,6.35 58.42,5.71 32.38,5.71 31.75,6.35 31.75,12.7 31.11,13.34 17.14,13.34 16.51,13.97 16.51,15.88 IC3.24
RA13
  Bottom 0.305: IC2B.26 83.19,16.51 81.92,15.24 73.03,15.24 71.75,16.51 IC4.28 59.05,16.51 58.42,15.88 58.42,6.99 57.78,6.35 33.02,6.35 32.38,6.99 32.38,13.34 31.75,13.97 18.41,13.97 17.78,14.61 17.78,22.23 16.51,23.5 IC3.25
RA14
  Bottom 0.305: IC2B.1 IC2A.1 88.27,11.43 87,12.7 73.03,12.7 71.75,13.97 IC4.29 60.33,13.97 59.69,13.34 59.69,5.71 59.05,5.08 31.75,5.08 31.11,5.71 31.11,12.06 30.48,12.7 14.61,12.7 13.97,13.34 13.97,15.88 IC3.22
RA15
  Bottom 0.305: IC3.20 11.43,15.88 11.43,12.7 12.06,12.06 29.84,12.06 30.48,11.43 30.48,5.08 31.11,4.45 59.69,4.45 60.33,5.08 60.33,12.06 60.96,12.7 71.75,12.7 73.03,11.43 IC4.3
RA16
  Bottom 0.305: IC3.19 8.89,23.5 10.16,22.23 10.16,12.06 10.79,11.43 29.21,11.43 29.84,10.79 29.84,4.45 30.48,3.81 81.28,3.81 81.92,4.45 81.92,8.26 81.28,8.89 IC4.2
RDY
  Bottom 0.305: IC1.2 CN1.2
RES
  Top 0.305: IC1.40 CN1.40
  Bottom 0.305: IC1.40 CN1.40
SOB
  Top 0.305: IC1.38 CN1.38
  Bottom 0.305: IC1.38 CN1.38
SPEED
  Top 0.305: IC5.13 15.24,78.74 14.61,78.11 12.06,78.11 11.43,78.74 11.43,85.09 12.06,85.72 25.4,85.72 26.04,86.36 D1.A
  Bottom 0.305: IC2.2 IC5.13 | 37.47,90.81 D1.A R6.2 | SW1.2 38.1,93.98 37.47,93.34 37.47,90.81 | IC3.7 6.35,52.07 6.99,52.7 29.84,52.7 30.48,53.34 50.16,53.34 50.8,53.98 50.8,60.33 51.44,60.96 52.07,60.96 52.7,61.59 52.7,82.55 52.07,83.19 38.1,83.19 37.47,83.82 37.47,90.81
SYNC
  Top 0.305: IC1.7 CN1.7
  Bottom 0.305: IC1.7 CN1.7
VCC
  Top 0.406: R1.2 CN1.8 IC1.8 35.56,39.37 | IC4.32 64.77,2.54 64.14,1.91 3.17,1.91 2.54,2.54 R4.2 3.81,37.47 3.81,50.16 4.45,50.8 10.16,50.8 11.43,49.53 13.34,49.53 | 35.56,39.37 33.66,39.37 33.02,40.01 33.02,48.9 32.38,49.53 13.34,49.53 | IC6.14 48.9,83.19 48.26,83.82 41.27,83.82 40.64,84.45 SW1.3 | 13.34,49.53 13.34,51.44 | 13.34,51.44 13.34,62.23 13.97,62.87 14.61,62.87 15.24,63.5 IC2.13 | REG1.1 34.92,25.4 35.56,26.04 35.56,39.37 | R11.2 96.52,7.62 97.79,8.89 102.23,8.89 102.87,9.53 R10.2 | R13.2 75.56,10.79 76.2,10.16 81.92,10.16 83.19,11.43 IC2B.28 | R3.2 13.34,51.44
  Bottom 0.406: IC4.30 IC4.31 IC4.32 | IC4.30 71.75,11.43 73.03,10.16 81.92,10.16 83.19,11.43 IC2B.28 86.36,11.43 87,10.79 87,8.26 87.63,7.62 C2.1 R11.2 | C12.2 IC2.14 IC2.13 15.24,68.58 13.97,69.85 13.97,75.56 13.34,76.2 10.16,76.2 | IC6.14 48.9,80.01 48.26,80.64 C11.2 47.62,81.92 46.99,82.55 36.83,82.55 36.2,83.19 36.2,84.45 35.56,85.09 20.95,85.09 20.32,84.45 C10.2 17.78,83.19 | IC1.8 CN1.8 | 15.24,83.19 5.71,83.19 5.08,82.55 IC5.9 5.08,76.83 5.71,76.2 10.16,76.2 | 15.24,83.19 17.78,83.19 | 17.78,83.19 IC5.14 | 15.24,83.19 IC5.2 | 10.16,76.2 IC2.4 | IC4.30 C1.1 | R12.2 102.23,20.32 102.87,19.68 R10.2
VCC33  (via drill 0.9)
  Top 0.406: C5.1 6.35,49.53 5.71,48.9 5.71,43.18 6.35,42.55 28.57,42.55 29.21,41.91 29.21,36.2 28.57,35.56 C4.1 27.94,31.11 28.57,30.48 REG1.3 | CN2.1 27.3,3.81 26.67,3.17 12.06,3.17 11.43,3.81 11.43,19.05 12.06,19.68 v12.7,19.68
  Bottom 0.406: 19.68,26.67 19.68,34.92 20.32,35.56 21.59,35.56 | 19.68,26.67 IC3.32 | 19.68,26.67 12.06,26.67 11.43,26.04 IC3.21 11.43,23.5 12.7,22.23 v12.7,19.68 C3.1 | 21.59,35.56 IC3.41 21.59,37.47 22.23,38.1 C13.+ | C4.1 21.59,35.56
VIDCLK
  Bottom 0.305: IC5.4 10.16,86.36 10.79,85.72 13.34,85.72 13.97,86.36 13.97,88.9 14.61,89.53 17.14,89.53 17.78,88.9 IC5.1 17.78,87 18.41,86.36 JP8.2
VPB
  Bottom 0.305: JP2.1 IC1.1

### Text on the board
tPlace: IC5 74LS86 | IC6 74LS02 | IC44 74LS393 | IC2 74LS74 | 1 | Atom Internal 32 RAM / ROMbox | with Noisekiller | Mk 2.2 2013-04-02 Ramoth | JP1 1-2 6502, 2-3 WD65C02 | CN3 | JP3 | JP2 | JP1 | JP2 Close=6502, Open=WD65C02 | DSKROMEN | 0.3 | IC4 29F010 | IC2A 32K SRAM 0.3" | IC1 6502 / WD65C02 | VCC | IC2B | CPU socket | JTAG